# EAGLE design opencanusb2 (EAGLE 9.6.2)

## Sheet 1 of 2
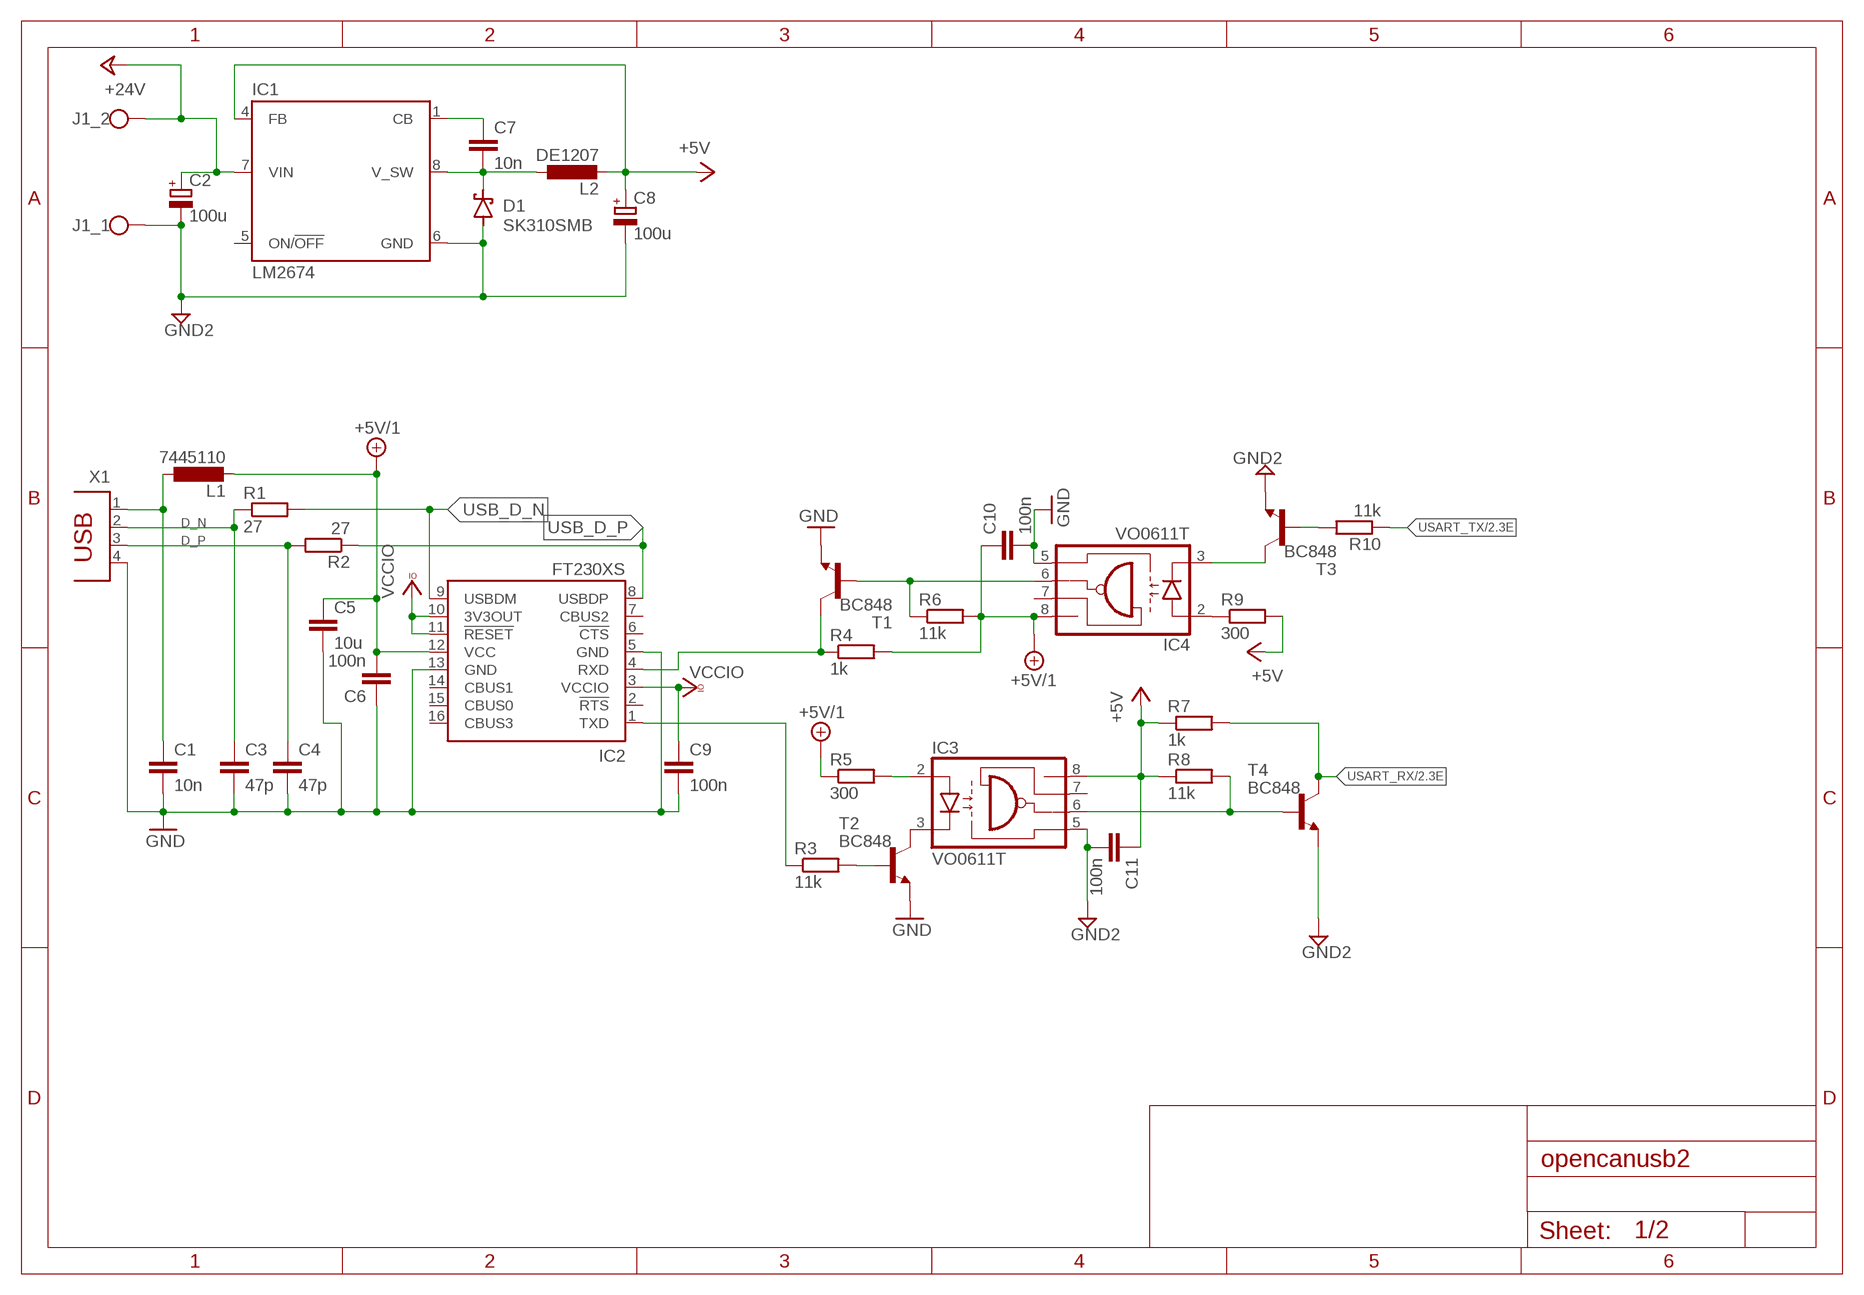
[diagram p0: schematic, sheet 1]

### Parts
C1  10n  C-EUC0402  [C0402]
C2  100u  CPOL-EUE5-8.5  [E5-8,5]
C3  47p  C-EUC0603  [C0603]
C4  47p  C-EUC0603  [C0603]
C5  10u  C-EUC1210K  [C1210K]
C6  100n  C-EUC0805  [C0805]
C7  10n  C-EUC0805  [C0805]
C8  100u  CPOL-EUE5-8.5  [E5-8,5]
C9  100n  C-EUC0805  [C0805]
C10  100n  C-EUC0805  [C0805]
C11  100n  C-EUC0805  [C0805]
D1  SK310SMB  MBRS130LT3  [SMB]
IC1  LM2674  [SOIC127P599X265-8N]
IC2  FT230XS  [SSOP16]
IC3  VO0611T  [SOIC127P610X323-8N]
IC4  VO0611T  [SOIC127P610X323-8N]
J1  DG300-7.5  [DG300-7.5]
L1  7445110  [7445110]
L2  DE1207  [INDC120120X800N]
R1  27  R-EU_R0805  [R0805]
R2  27  R-EU_R0805  [R0805]
R3  11k  R-EU_R1206  [R1206]
R4  1k  R-EU_R0805  [R0805]
R5  300  R-EU_R0805  [R0805]
R6  11k  R-EU_R1206  [R1206]
R7  1k  R-EU_R0805  [R0805]
R8  11k  R-EU_R1206  [R1206]
R9  300  R-EU_R0805  [R0805]
R10  11k  R-EU_R1206  [R1206]
T1  BC848  [SOT23]
T2  BC848  [SOT23]
T3  BC848  [SOT23]
T4  BC848  [SOT23]
X1  PN61729  [PN61729]

### Nets
+5V: C8.+ C11.1 IC1.4(FB) IC3.8(VCC) L2.2 R7.1 R8.1 R9.2 ; also sheet 2
+5V/1: C5.1 C6.2 C10.1 IC2.12(VCC) IC4.8(VCC) L1.2 R4.2 R5.1 R6.2
+24V [+24V]: C2.+ IC1.7(VIN) J1.P$2 ; also sheet 2
D_N: C3.1 R1.1 X1.2
D_P: C4.1 R2.2 X1.3
GND: C1.2 C3.2 C4.2 C5.2 C6.1 C9.2 C10.2 IC2.5(GND) IC2.13(GND) IC4.5(GND) T1.2(E) T2.2(E) X1.4
GND2: C2.- C8.- C11.2 D1.A IC1.6(GND) IC3.5(GND) J1.P$1 T3.2(E) T4.2(E) ; also sheet 2
N$1: IC3.2(A) R5.2
N$2: IC2.1(TXD) R3.1
N$3: IC3.3(C) T2.3(C)
N$4: IC4.2(A) R9.1
N$5: IC4.3(C) T3.3(C)
N$6: IC4.6(VO) R6.1 T1.1(B)
N$7: R3.2 T2.1(B)
N$8: IC3.6(VO) R8.2 T4.1(B)
N$9: R10.2 T3.1(B)
N$10: IC2.4(RXD) R4.1 T1.3(C)
N$25: C1.1 L1.1 X1.1
N$32: C7.2 D1.C IC1.8(V_SW) L2.1
N$33: C7.1 IC1.1(CB)
USART_RX [signal]: R7.2 T4.3(C) ; also sheet 2
USART_TX [signal]: R10.1 ; also sheet 2
USB_D_N [signal]: IC2.9(USBDM) R1.2
USB_D_P [signal]: IC2.8(USBDP) R2.1
VCCIO: C9.1 IC2.3(VCCIO) IC2.10(3V3OUT) IC2.11(!RESET)
Unconnected: IC2.2(!RTS) IC2.6(!CTS) IC2.7(CBUS2) IC2.14(CBUS1) IC2.15(CBUS0) IC2.16(CBUS3) IC3.7(VE) IC4.7(VE)

## Sheet 2 of 2
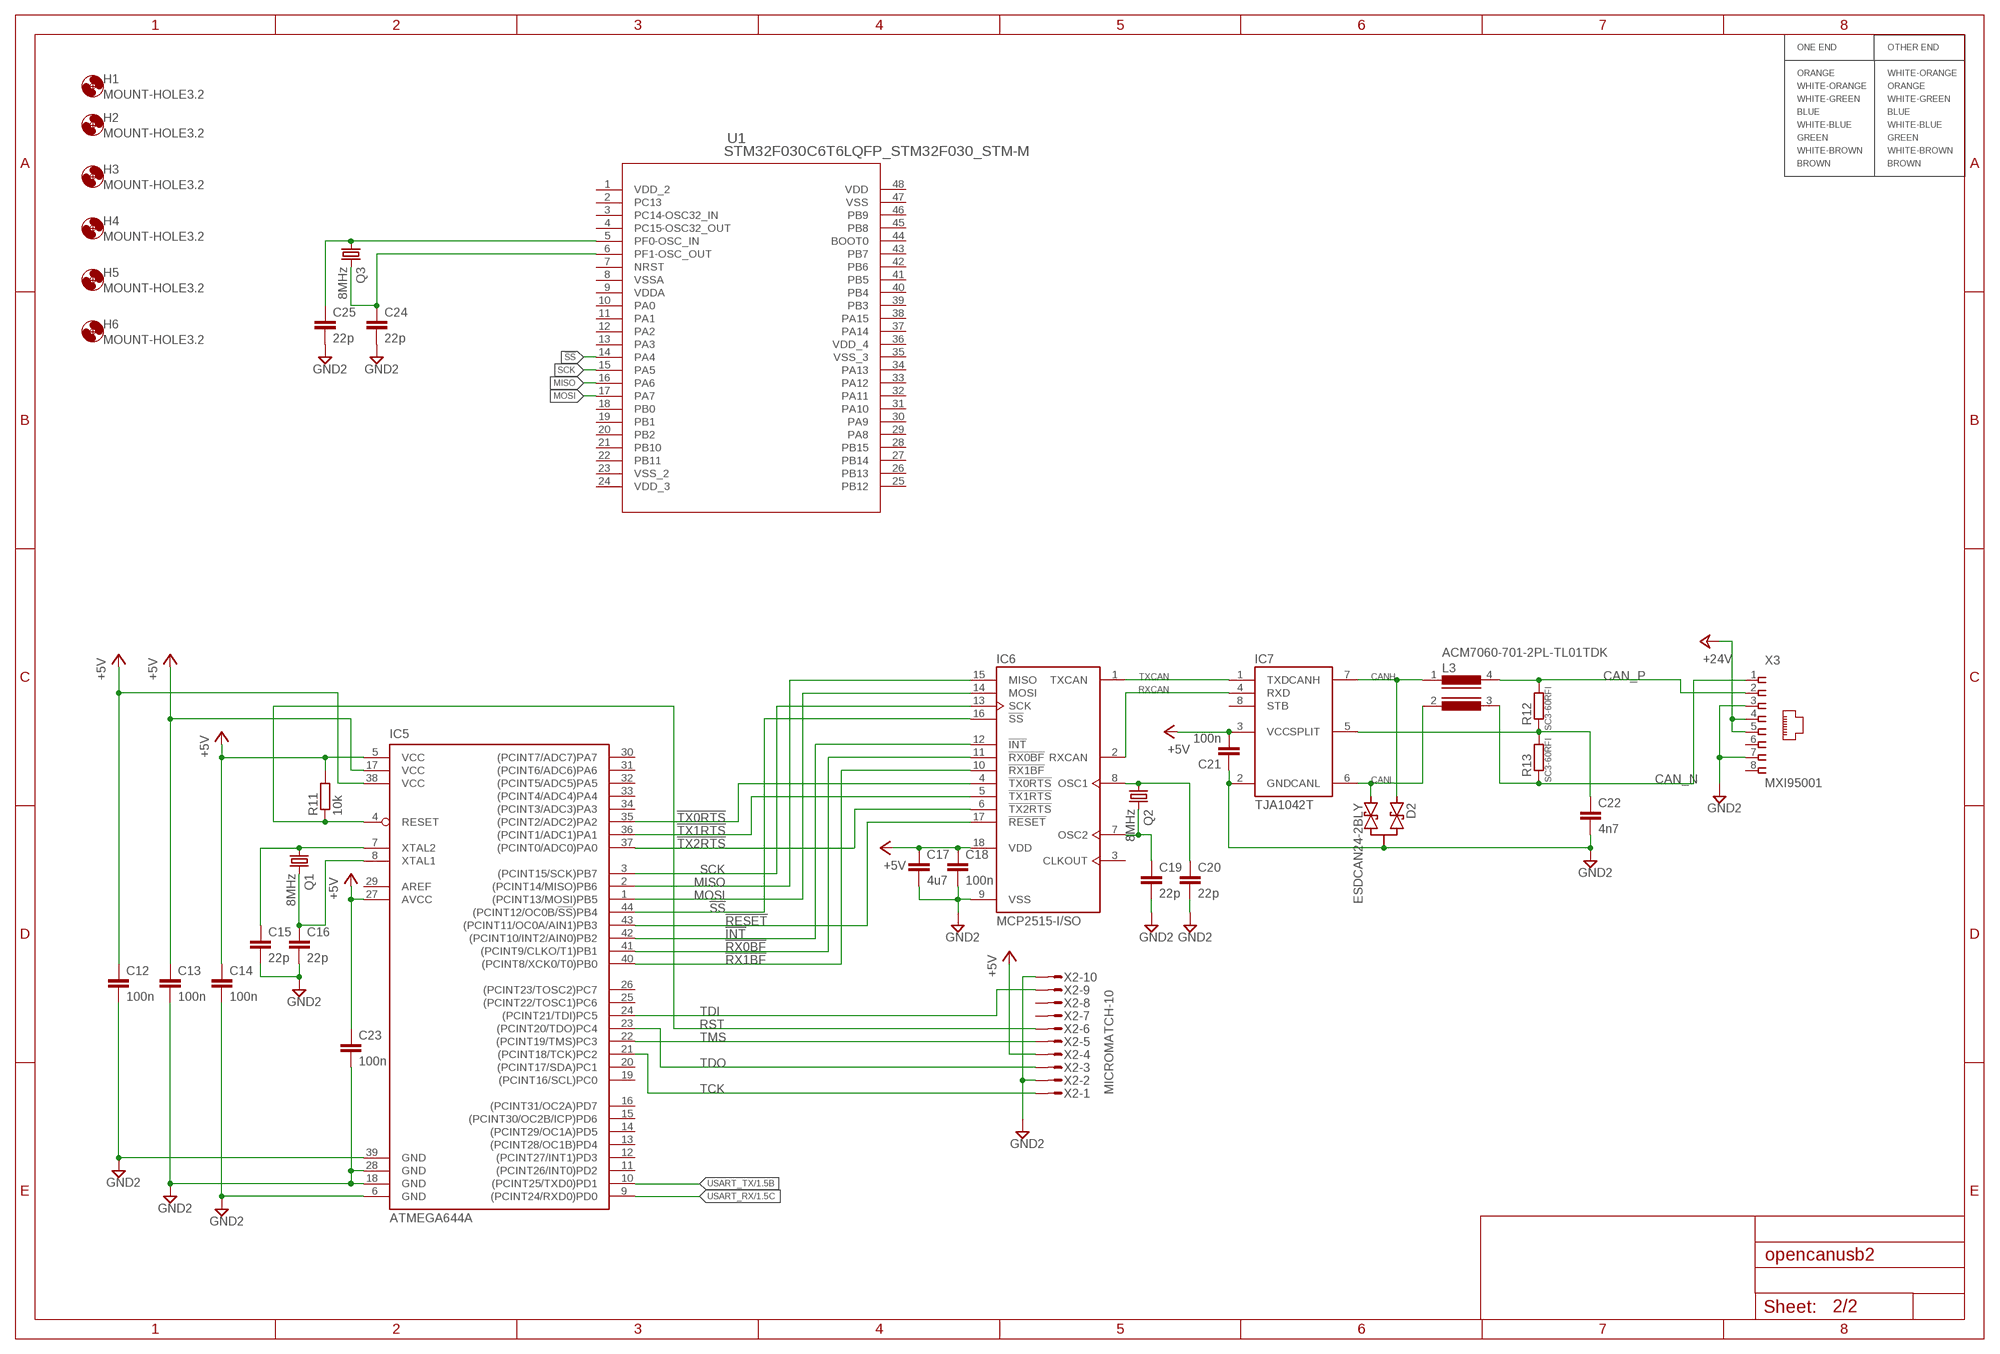
[diagram p1: schematic, sheet 2]

### Parts
C12  100n  C-EUC0805  [C0805]
C13  100n  C-EUC0805  [C0805]
C14  100n  C-EUC0805  [C0805]
C15  22p  C-EUC0805  [C0805]
C16  22p  C-EUC0805  [C0805]
C17  4u7  C-EUC0805  [C0805]
C18  100n  C-EUC0805  [C0805]
C19  22p  C-EUC0805  [C0805]
C20  22p  C-EUC0805  [C0805]
C21  100n  C-EUC0805  [C0805]
C22  4n7  C-EUC0805  [C0805]
C23  100n  C-EUC0805  [C0805]
C24  22p  C-EUC0805  [C0805]
C25  22p  C-EUC0805  [C0805]
D2  ESDCAN24-2BLY  [SOT95P255X140-3N]
H1  MOUNT-HOLE3.2  [3,2]
H2  MOUNT-HOLE3.2  [3,2]
H3  MOUNT-HOLE3.2  [3,2]
H4  MOUNT-HOLE3.2  [3,2]
H5  MOUNT-HOLE3.2  [3,2]
H6  MOUNT-HOLE3.2  [3,2]
IC5  ATMEGA644A  [TQFP44]
IC6  MCP2515-I/SO  [SOIC127P1030X265-18N]
IC7  TJA1042T  [SOIC127P600X265-8N]
L3  ACM7060-701-2PL-TL01TDK  [ACM7060-701-2PL-TL01TDK]
Q1  8MHz  CRYSTALHC49UP  [HC49UP]
Q2  8MHz  CRYSTALHC49UP  [HC49UP]
Q3  8MHz  CRYSTALHC49UP  [HC49UP]
R11  10k  R-EU_R1206  [R1206]
R12  SC3-60RFI  SC3-XXRFI  [RESC3163X76N]
R13  SC3-60RFI  SC3-XXRFI  [RESC3163X76N]
U1  STM32F030C6T6LQFP_STM32F030_STM-M  [LQFP_STM32F030_STM-M]
X2  MICROMATCH-10  [MICROMATCH-10]
X3  MXI95001  [MXI950001]

### Nets
!INT [signal]: IC5.42((PCINT10/INT2/AIN0)PB2) IC6.12(!INT)
!RESET [signal]: IC5.43((PCINT11/OC0A/AIN1)PB3) IC6.17(!RESET)
!RX0BF [signal]: IC5.41((PCINT9/CLKO/T1)PB1) IC6.11(!RX0BF)
!RX1BF [signal]: IC5.40((PCINT8/XCK0/T0)PB0) IC6.10(!RX1BF)
!SS [signal]: IC5.44((PCINT12/OC0B/!SS!)PB4) IC6.16(!SS) U1.14(PA4)
!TX0RTS: IC5.35((PCINT2/ADC2)PA2) IC6.4(!TX0RTS)
!TX1RTS [signal]: IC5.36((PCINT1/ADC1)PA1) IC6.5(!TX1RTS)
!TX2RTS [signal]: IC5.37((PCINT0/ADC0)PA0) IC6.6(!TX2RTS)
+5V: C12.1 C13.1 C14.1 C17.1 C18.1 C21.2 C23.1 IC5.5(VCC) IC5.17(VCC) IC5.27(AVCC) IC5.38(VCC) IC6.18(VDD) IC7.3(VCC) R11.2 X2.4 ; also sheet 1
+24V [+24V]: X3.4 X3.5 ; also sheet 1
CAN_N: L3.3 R13.1 X3.1
CAN_P: L3.4 R12.2 X3.2
CANH: D2.1 IC7.7(CANH) L3.1
CANL: D2.2 IC7.6(CANL) L3.2
GND2: C12.2 C13.2 C14.2 C15.2 C16.2 C17.2 C18.2 C19.2 C20.2 C21.1 C22.2 C23.2 C24.2 C25.2 D2.3 IC5.6(GND) IC5.18(GND) IC5.28(GND) IC5.39(GND) IC6.9(VSS) IC7.2(GND) X2.2 X2.10 X3.3 X3.7 ; also sheet 1
MISO [signal]: IC5.2((PCINT14/MISO)PB6) IC6.15(MISO) U1.16(PA6)
MOSI [signal]: IC5.1((PCINT13/MOSI)PB5) IC6.14(MOSI) U1.17(PA7)
N$11: C25.1 Q3.1 U1.5(PF0-OSC_IN)
N$12: C24.1 Q3.2 U1.6(PF1-OSC_OUT)
N$17 [signal]: C15.1 IC5.7(XTAL2) Q1.1
N$22 [signal]: C19.1 IC6.7(OSC2) Q2.2
N$24 [signal]: C16.1 IC5.8(XTAL1) Q1.2
N$26 [signal]: C20.1 IC6.8(OSC1) Q2.1
N$31: C22.1 IC7.5(SPLIT) R12.1 R13.2
RST [signal]: IC5.4(RESET) R11.1 X2.6
RXCAN [signal]: IC6.2(RXCAN) IC7.4(RXD)
SCK [signal]: IC5.3((PCINT15/SCK)PB7) IC6.13(SCK) U1.15(PA5)
TCK: IC5.21((PCINT18/TCK)PC2) X2.1
TDI: IC5.24((PCINT21/TDI)PC5) X2.9
TDO: IC5.23((PCINT20/TDO)PC4) X2.3
TMS: IC5.22((PCINT19/TMS)PC3) X2.5
TXCAN [signal]: IC6.1(TXCAN) IC7.1(TXD)
USART_RX [signal]: IC5.9((PCINT24/RXD0)PD0) ; also sheet 1
USART_TX [signal]: IC5.10((PCINT25/TXD0)PD1) ; also sheet 1
Unconnected: IC5.11((PCINT26/INT0)PD2) IC5.12((PCINT27/INT1)PD3) IC5.13((PCINT28/OC1B)PD4) IC5.14((PCINT29/OC1A)PD5) IC5.15((PCINT30/OC2B/ICP)PD6) IC5.16((PCINT31/OC2A)PD7) IC5.19((PCINT16/SCL)PC0) IC5.20((PCINT17/SDA)PC1) IC5.25((PCINT22/TOSC1)PC6) IC5.26((PCINT23/TOSC2)PC7) IC5.29(AREF) IC5.30((PCINT7/ADC7)PA7) IC5.31((PCINT6/ADC6)PA6) IC5.32((PCINT5/ADC5)PA5) IC5.33((PCINT4/ADC4)PA4) IC5.34((PCINT3/ADC3)PA3) IC6.3(CLKOUT) IC7.8(STB) U1.2(PC13) U1.3(PC14-OSC32_IN) U1.4(PC15-OSC32_OUT) U1.7(NRST) U1.8(VSSA) U1.10(PA0) U1.11(PA1) U1.12(PA2) U1.13(PA3) U1.18(PB0) U1.19(PB1) U1.20(PB2) U1.21(PB10) U1.22(PB11) U1.23(VSS_2) U1.25(PB12) U1.26(PB13) U1.27(PB14) U1.28(PB15) U1.29(PA8) U1.30(PA9) U1.31(PA10) U1.32(PA11) U1.33(PA12) U1.34(PA13) U1.35(VSS_3) U1.37(PA14) U1.38(PA15) U1.39(PB3) U1.40(PB4) U1.41(PB5) U1.42(PB6) U1.43(PB7) U1.44(BOOT0) U1.45(PB8) U1.46(PB9) U1.47(VSS) X2.7 X2.8 X3.6 X3.8

### Notes on the sheet
- ONE END | OTHER END
- ORANGE | WHITE-ORANGE
- WHITE-ORANGE | ORANGE
- WHITE-GREEN | WHITE-GREEN
- BLUE | BLUE
- WHITE-BLUE | WHITE-BLUE
- GREEN | GREEN
- WHITE-BROWN | WHITE-BROWN
- BROWN | BROWN

## Power pins joined to a net without a drawn wire
ON/!OFF: IC1.5(ON/!OFF)
VDD: U1.48(VDD)
VDD_2: U1.1(VDD_2)
VDD_3: U1.24(VDD_3)
VDD_4: U1.36(VDD_4)
VDDA: U1.9(VDDA)

## Library data of the parts
C1 C3-C7 C9-C25 = rcl:C-EU: CAPACITOR, European symbol; SPICEPREFIX: C
C2 C8 = rcl:CPOL-EU: POLARIZED CAPACITOR, European symbol; SPICEPREFIX: C
D1 = diode:MBRS130LT3: Schottky Power Rectifier Source: http://www.onsemi.com/pub/Collateral/MBRS130LT3-D.PDF
D2 = canusb:ESDCAN24-2BLY: ESDCAN01-2BLY Automotive dual-line Transil™,transient voltage suppressor (TVS) for CAN bus
H1-H6 = holes:MOUNT-HOLE: MOUNTING HOLE with drill center marker
IC1 = canusb:LM2674: LM2674 SIMPLE SWITCHER® Power Converter High Efficiency 500-mA Step-Down Voltage Regulator
IC2 = ftdichip:FT230X: USB to BASIC UART IC Auto generated by make-symbol-device-package-bsdl.ulp Rev. 43 Source: Data sheet <http://www.ftdichip.com/Support/Documents/DataSheets/ICs/DS_FT230X.pdf>
IC3 IC4 = cnc_driver:VO0611T: VO0611T - High Speed Optocoupler, 10 MBd, SOIC-8 Package The VO06xxT family are single and dual channel 10 MBd optocoupler utilizing a high efficient input LED coupled with an integrated optical photodiode IC detector. The detector has an open drain NMOS-transister output, providing less leakage compared to an open collector Schottky clamped transister output. For the single channel type, an enable function on pin 7 allows the detector to be strobed. The internal shield provides a guaranteed common mode transient immunity of 5 kV/μs for the VO0601T and VO0631T and 15 kV/μs for the VO0611T and VO0661T. The use of a 0.1 μF bypass capacitor connected between pin 5 and 8 is recommended.
IC5 = atmel:ATMEGA644: 8-bit Microcontroller with 64K Bytes In-System Programmable Flash Source: http://www.atmel.com/dyn/resources/prod_documents/doc2593.pdf; MPN: ATMEGA644PV-10AU; OC_FARNELL: 1455123; OC_NEWARK: 58M3748
IC6 = canusb:MCP2515: MCP2515 - Stand-Alone CAN Controller with SPI Interface
IC7 = canusb:TJA1042: TJA1042 - High-speed CAN transceiver with Standby mode General description he TJA1042 is a high-speed CAN transceiver that provides an interface between aController Area Network (CAN) protocol controller and the physical two-wire CAN bus.The transceiver is designed for high-speed (up to 1 Mbit/s) CAN applications in theautomotive industry, providing the differential transmit and receive capability to (amicrocontroller with) a CAN protocol controller. The TJA1042 is a step up from the TJA1040, PCA82C250 and PCA82C251 high-speedCAN transceivers. It offers improved ElectroMagnetic Compatibility (EMC) andElectroStatic Discharge (ESD) performance, and also features: Ideal passive behavior to the CAN bus when the supply voltage is off A very low-current Standby mode with bus wake-up capability Direct interfacing to microcontrollers with 3 V to 5 V supply voltages on TJA1042T/3 and TJA1042TK/3These features make the TJA1042 an excellent choice for all types of HS-CAN networks, in nodes that require a low-power mode with wake-up capability via the CAN bus Features General Fully ISO 11898-2 and ISO 11898-5 compliant Suitable for 12 V and 24 V systems Low ElectroMagnetic Emission (EME) and high ElectroMagnetic Immunity (EMI) VIO input on TJA1042T/3 and TJA1042TK/3 allows for direct interfacing with 3 V to 5 V microcontrollers (available in SO8 and very small HVSON8 packages respectively) SPLIT voltage output on TJA1042T for stabilizing the recessive bus level (available inSO8 package only) Low-power management Very low-current Standby mode with host and bus wake-up capability Functional behavior predictable under all supply conditions Transceiver disengages from the bus when not powered up (zero load) Protections High ESD handling capability on the bus pins Bus pins protected against transients in automotive environments Transmit Data (TXD) dominant time-out function Bus-dominant time-out function in Standby mode Undervoltage detection on pins VCC and VIO Thermally protected
J1 = canusb:DG300-7.5: DEGSON DG300-7.5 PCB terminal block
L1 = canusb:7445110: WE-PD3 SMT Shielded Power Inductor
L2 = cnc_driver:DE1207: DE1207-10 FERROCORE Dławik: drutowy; SMD; 10uH; 6,7A; 19mΩ; ±20%; 12x12x8mm; -40÷85°C
L3 = canusb:ACM7060-701-2PL-TL01TDK: ACM7060-701-2PL-TL01 TDK Common mode filter
Q1-Q3 = crystal:CRYSTAL: CRYSTAL; OC_FARNELL: unknown; OC_NEWARK: unknown
R1-R11 = rcl:R-EU_: RESISTOR, European symbol; SPICEPREFIX: R
R12 R13 = canusb:SC3: SC3 Series - High Power Chip Resistors 3 watts in a 1 watt size package Resistance range from 1R0 to 10K Tolerances to ± 1% AEC-Q200 Qualified link to datascheet: http://www.farnell.com/datasheets/2710392.pdf
T1-T4 = transistor:BC848: NPN TRANSISTOR
U1 = canusb:STM32F030C6T6; BUILT_BY: EMA_Matt; COPYRIGHT: Copyright (C) 2018 Accelerated Designs. All rights reserved; DATASHEET: https://www.st.com/content/ccc/resource/technical/document/datasheet/a4/5d/0b/0e/87/c4/4d/71/DM00088500.pdf/files/DM00088500.pdf/jcr:content/translations/en.DM00088500.pdf; MANUFACTURER_PART_NUMBER: STM32F030C6T6; SOURCELIBRARY: Add_to_database_2020-12-31; VENDOR: STMicroelectronics
X1 = con-berg:PN61729: BERG USB connector; OC_FARNELL: unknown; OC_NEWARK: unknown
X2 = con-amp-micromatch:MICROMATCH-10: MicroMaTch 10 8-215464-0 / 1-215464-0 Drawing Number C-215464 DDEController.pdf; MF: FARNELL; MPN: 8-215464-0; OC_FARNELL: 3784654; OC_NEWARK: 19J6430
X3 = canusb:MXI95001: 95501-2881 MOLEX Socket; RJ45; PIN: 8; Cat: 3; lowprofile; setup: 8p8c; THT

## Net classes
1 signal: width 0.305 mm, drill 0.4 mm, clearance 0.305 mm
2 +24V: clearance 1.016 mm

## Board
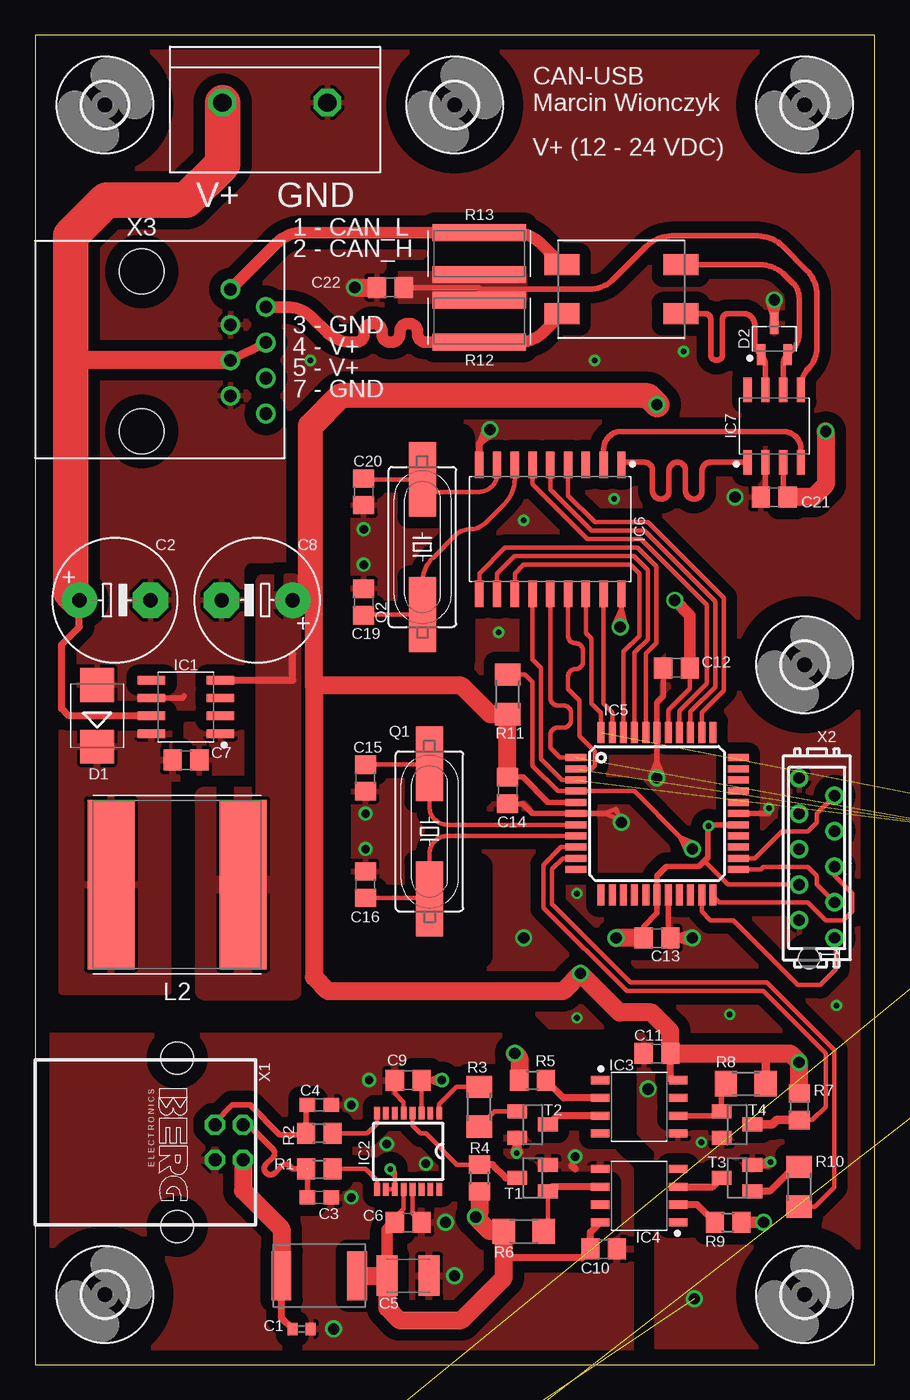
[diagram p2: board, top side]
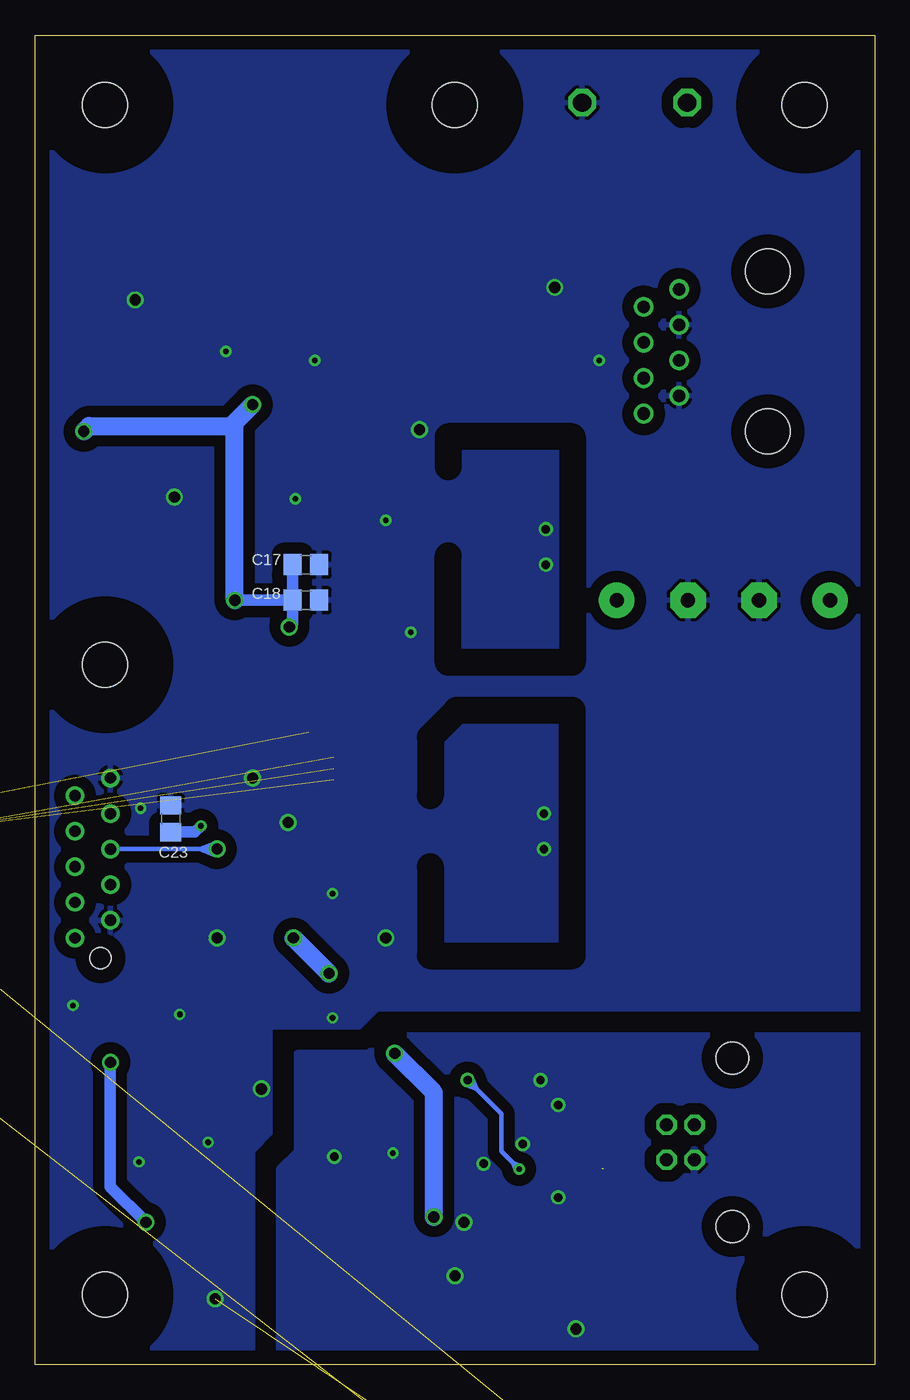
[diagram p3: board, bottom side, seen from below]

Size 60 x 95 mm. Coordinates in mm from the lower left corner, seen from the top.
Outline: 0,0 60,0 60,95 0,95 0,0
Copper layers (1*16): Top 0.035mm / dielectric 1.5mm / Bottom 0.035mm
Design rules "default *": minimum track width 6mil, minimum drill 0.35mm, track to track 6mil, track to pad 6mil, pad to pad 6mil, via to via 6mil, smd to smd 6mil, copper to edge 40mil, drill to drill 6mil, minimum pad ring 10mil, minimum via ring 8mil, stop-mask expansion 4mil, vias tented up to drill 0.4mm, thermal gap 10mil
tRestrict: 11 lines
bRestrict: 11 lines

### Footprints (pad centres in the part's own frame; a part is rotated, then mirrored left to right if it is on the bottom)
C0402 = smd 0.7 x 0.9: 1 -0.65,0; 2 0.65,0
E5-8,5 = drill 1.016 pad 2.54: + -2.54,0 | drill 1.016 pad 2.54 octagon: - 2.54,0
C0603 = smd 1.1 x 1: 1 -0.85,0; 2 0.85,0
C1210K = smd 1.5 x 2.9: 1 -1.5,0; 2 1.5,0
C0805 = smd 1.3 x 1.5: 1 -0.95,0; 2 0.95,0
SMB = smd 2.4 x 2.4: A 2.2,0; C -2.2,0
SOT95P255X140-3N = smd 1.494 x 0.598: 1 -1.107,0.95; 2 -1.107,-0.95; 3 1.107,0
3,2 = hole 3.2: 0,0
SOIC127P599X265-8N = smd 1.967 x 0.599: 1 -2.469,1.905; 2 -2.469,0.635; 3 -2.469,-0.635; 4 -2.469,-1.905; 5 2.469,-1.905; 6 2.469,-0.635; 7 2.469,0.635; 8 2.469,1.905
SSOP16 = smd 0.914 x 0.406: 1 -2.718,2.223; 2 -2.718,1.587; 3 -2.718,0.953; 4 -2.718,0.318; 5 -2.718,-0.318; 6 -2.718,-0.953; 7 -2.718,-1.587; 8 -2.718,-2.223; 9 2.718,-2.223; 10 2.718,-1.587; 11 2.718,-0.953; 12 2.718,-0.318; 13 2.718,0.318; 14 2.718,0.953; 15 2.718,1.587; 16 2.718,2.223
SOIC127P610X323-8N = smd 1.347 x 0.582: 1 -2.782,1.905; 2 -2.782,0.635; 3 -2.782,-0.635; 4 -2.782,-1.905; 5 2.782,-1.905; 6 2.782,-0.635; 7 2.782,0.635; 8 2.782,1.905
TQFP44 = smd 1.5 x 0.5: 1 -5.8,4; 2 -5.8,3.2; 3 -5.8,2.4; 4 -5.8,1.6; 5 -5.8,0.8; 6 -5.8,0; 7 -5.8,-0.8; 8 -5.8,-1.6; 9 -5.8,-2.4; 10 -5.8,-3.2; 11 -5.8,-4; 23 5.8,-4; 24 5.8,-3.2; 25 5.8,-2.4; 26 5.8,-1.6; 27 5.8,-0.8; 28 5.8,0; 29 5.8,0.8; 30 5.8,1.6; 31 5.8,2.4; 32 5.8,3.2; 33 5.8,4 | smd 0.5 x 1.5: 12 -4,-5.8; 13 -3.2,-5.8; 14 -2.4,-5.8; 15 -1.6,-5.8; 16 -0.8,-5.8; 17 0,-5.8; 18 0.8,-5.8; 19 1.6,-5.8; 20 2.4,-5.8; 21 3.2,-5.8; 22 4,-5.8; 34 4,5.8; 35 3.2,5.8; 36 2.4,5.8; 37 1.6,5.8; 38 0.8,5.8; 39 0,5.8; 40 -0.8,5.8; 41 -1.6,5.8; 42 -2.4,5.8; 43 -3.2,5.8; 44 -4,5.8
SOIC127P1030X265-18N = smd 1.901 x 0.599: 1 -4.605,5.08; 2 -4.605,3.81; 3 -4.605,2.54; 4 -4.605,1.27; 5 -4.605,0; 6 -4.605,-1.27; 7 -4.605,-2.54; 8 -4.605,-3.81; 9 -4.605,-5.08; 10 4.605,-5.08; 11 4.605,-3.81; 12 4.605,-2.54; 13 4.605,-1.27; 14 4.605,0; 15 4.605,1.27; 16 4.605,2.54; 17 4.605,3.81; 18 4.605,5.08
SOIC127P600X265-8N = smd 1.746 x 0.592: 1 -2.585,1.905; 2 -2.585,0.635; 3 -2.585,-0.635; 4 -2.585,-1.905; 5 2.585,-1.905; 6 2.585,-0.635; 7 2.585,0.635; 8 2.585,1.905
DG300-7.5 = drill 1.3 octagon: P$1 -3.75,0; P$2 3.75,0
7445110 = smd 1.4 x 3.5: 1 -2.7,0; 2 2.7,0
INDC120120X800N = smd 3.362 x 12.112: 1 -4.725,0; 2 4.725,0
ACM7060-701-2PL-TL01TDK = smd 2.5 x 1.5: 1 -4.25,1.75; 2 -4.25,-1.75; 3 4.25,-1.75; 4 4.25,1.75
HC49UP = smd 5.334 x 1.93: 1 -4.826,0; 2 4.826,0
R0805 = smd 1.3 x 1.5: 1 -0.95,0; 2 0.95,0
R1206 = smd 1.6 x 1.803: 1 -1.422,0; 2 1.422,0
RESC3163X76N = smd 1.198 x 6.67: 1 -1.501,0; 2 1.501,0
SOT23 = smd 1 x 1.4: 1 -0.95,-1.1; 2 0.95,-1.1; 3 0,1.1
LQFP_STM32F030_STM-M = smd 1.562 x 0.279: 1 -4.375,2.75; 2 -4.375,2.25; 3 -4.375,1.75; 4 -4.375,1.25; 5 -4.375,0.75; 6 -4.375,0.25; 7 -4.375,-0.25; 8 -4.375,-0.75; 9 -4.375,-1.25; 10 -4.375,-1.75; 11 -4.375,-2.25; 12 -4.375,-2.75; 25 4.375,-2.75; 26 4.375,-2.25; 27 4.375,-1.75; 28 4.375,-1.25; 29 4.375,-0.75; 30 4.375,-0.25; 31 4.375,0.25; 32 4.375,0.75; 33 4.375,1.25; 34 4.375,1.75; 35 4.375,2.25; 36 4.375,2.75 | smd 0.279 x 1.562: 13 -2.75,-4.375; 14 -2.25,-4.375; 15 -1.75,-4.375; 16 -1.25,-4.375; 17 -0.75,-4.375; 18 -0.25,-4.375; 19 0.25,-4.375; 20 0.75,-4.375; 21 1.25,-4.375; 22 1.75,-4.375; 23 2.25,-4.375; 24 2.75,-4.375; 37 2.75,4.375; 38 2.25,4.375; 39 1.75,4.375; 40 1.25,4.375; 41 0.75,4.375; 42 0.25,4.375; 43 -0.25,4.375; 44 -0.75,4.375; 45 -1.25,4.375; 46 -1.75,4.375; 47 -2.25,4.375; 48 -2.75,4.375
PN61729 = drill 0.95 octagon: 1 1.25,4.71; 2 -1.25,4.71; 3 -1.25,2.71; 4 1.25,2.71 | hole 2.3: -6.02,0; 6.02,0
MICROMATCH-10 = drill 0.813: 1 5.715,1.27; 2 4.445,-1.27; 3 3.175,1.27; 4 1.905,-1.27; 5 0.635,1.27; 6 -0.635,-1.27; 7 -1.905,1.27; 8 -3.175,-1.27; 9 -4.445,1.27; 10 -5.715,-1.27 | hole 1.5: 7.16,-0.55
MXI950001 = drill 0.9: 1 4.445,-6.35; 2 3.175,-8.89; 3 1.905,-6.35; 4 0.635,-8.89; 5 -0.635,-6.35; 6 -1.905,-8.89; 7 -3.175,-6.35; 8 -4.445,-8.89 | hole 3.2: 5.715,0; -5.715,0

### Placement (x,y rotation side)
C1  19.05,2.54 0 top
C2  5.71,54.61 0 top
C3  20.32,11.94 0 top
C4  20.32,18.54 0 top
C5  26.67,6.35 0 top
C6  26.67,10.16 180 top
C7  10.79,43.18 180 top
C8  15.88,54.61 180 top
C9  26.67,20.32 180 top
C10  40.64,8.26 0 top
C11  44.45,22.23 180 top
C12  45.85,49.78 180 top
C13  44.45,30.48 0 top
C14  33.78,41.02 270 top
C15  23.62,41.91 270 top
C16  23.62,34.29 90 top
C17  40.64,57.15 0 bottom
C18  40.64,54.61 0 bottom
C19  23.5,54.48 90 top
C20  23.5,62.36 270 top
C21  52.83,61.98 0 top
C22  25.4,76.96 180 top
C23  50.29,38.99 90 bottom
C24  -8.26,-31.75 0 top  (outside the outline)
C25  -8.26,-38.1 0 top  (outside the outline)
D1  4.45,46.35 90 top
D2  52.83,73.28 90 top
H1  55,90 0 top
H2  55,5 0 top
H3  5,90 0 top
H4  55,50 0 top
H5  5,5 0 top
H6  30,90 0 top
IC1  10.79,46.99 180 top
IC2  26.67,15.24 270 top
IC3  43.18,18.41 0 top
IC4  43.18,12.06 180 top
IC5  44.45,39.37 0 top
IC6  36.83,59.69 270 top
IC7  52.83,67.06 90 top
J1  17.14,90.17 180 top
L1  20.32,6.35 0 top
L2  10.16,34.29 0 top
L3  41.91,76.83 180 top
Q1  28.19,38.1 270 top
Q2  27.69,58.42 270 top
Q3  88.9,44.45 180 top  (outside the outline)
R1  20.32,13.97 0 top
R2  20.32,16.51 180 top
R3  31.75,18.41 270 top
R4  31.75,13.34 270 top
R5  35.56,20.32 0 top
R6  34.92,9.53 180 top
R7  54.61,18.41 270 top
R8  50.8,20.07 180 top
R9  49.53,10.16 0 top
R10  54.61,12.7 90 top
R11  33.78,47.88 270 top
R12  31.75,74.55 270 top
R13  31.75,79.38 270 top
T1  35.56,13.34 90 top
T2  35.56,17.14 270 top
T3  50.16,13.34 90 top
T4  50.16,17.14 270 top
U1  88.9,34.29 270 top  (outside the outline)
X1  10.16,15.88 270 top
X2  55.88,36.2 270 top
X3  7.62,72.39 90 top

### Tracks (layer width: path | path; a pad name or v marks a point on that pad's centre or on a via)
!INT
  Top 0.305: IC6.12 34.29,56.52 34.92,57.15 42.55,57.15 43.18,56.52 43.18,52.07 42.05,50.94 IC5.42
!RESET
  Top 0.305: IC6.17 40.64,47.22 41.25,46.61 IC5.43
!RX0BF
  Top 0.305: IC6.11 33.02,56.52 34.27,57.76 42.8,57.76 43.79,56.77 43.79,51.82 42.85,50.88 IC5.41
!RX1BF
  Top 0.305: 31.75,54.61 IC6.10 31.75,56.52 33.6,58.37 43.05,58.37 44.4,57.02 44.4,51.56 43.65,50.82 IC5.40
!SS  (1 unrouted)
  Top 0.305: IC5.44 40.45,46.55 39.78,47.22 39.78,51.88 39.37,52.28 IC6.16
!TX0RTS
  Top 0.305: 38.1,64.77 IC6.4 38.1,62.1 40.01,60.2 43.81,60.2 49.23,54.78 49.23,48.16 47.65,46.59 IC5.35
!TX1RTS
  Top 0.305: IC5.36 46.85,46.65 48.62,48.41 48.62,54.53 43.55,59.59 39.75,59.59 36.83,62.51 IC6.5
!TX2RTS
  Top 0.305: IC5.37 46.05,46.71 48.01,48.67 48.01,54.27 43.3,58.98 39.5,58.98 35.56,62.92 IC6.6
+5V  (via drill 0.4, 0.8)
  Top 0.305: IC5.38 45.25,46.77 46.8,48.32 C12.1 | X2.4 49.53,34.29 47.84,35.98
  Top 0.406: IC5.5 36.66,40.17 34.86,41.97 C14.1 | C13.1 43.5,31.31 44.45,32.26 IC5.17 44.45,34.92 45.12,35.59 47.45,35.59 47.84,35.98 48.1,36.24 48.1,38.45 v48.13,38.48 | IC7.3 53.47,62.29 C21.2 | IC6.18 41.91,53.9 | 41.91,53.9 41.91,52.79 v41.83,52.7 | IC3.8 45.47,20.32 45.4,20.39 | 41.91,53.9 41.46,52.86 v41.83,52.7 | 41.91,53.9 42.21,52.81 v41.83,52.7 | IC5.27 48.22,38.57 v48.13,38.48 | 48.26,38.35 v48.13,38.48
  Top 0.508: IC1.4 18.41,48.9 18.41,50.8 | 45.4,20.39 C11.1
  Top 0.61: 52.22,22.23 R8.1
  Top 0.813: R9.2 v52.07,10.16 | C12.1 46.8,53.53 v45.72,54.61
  Top 1.27: C14.1 R11.2 32.54,46.46 30.48,48.51 19.94,48.51 | R7.1 v54.61,21.59 53.98,22.23 52.22,22.23 C11.1 45.4,23.82 44.07,25.15 41.78,25.15 v38.99,27.94 37.72,26.67 20.95,26.67 19.94,27.69 19.94,48.51 | C13.1 v41.53,30.48 | C8.+ 19.68,54.61 19.94,54.61 19.94,48.51 | v56.52,66.67 56.52,62.87 55.63,61.98 C21.2
  Top 1.8: 19.68,54.61 19.68,67.06 21.84,69.22 43.81,69.22 v44.45,68.58
  Bottom 0.813: C17.1 C18.1 | v52.07,10.16 54.61,12.7 v54.61,21.59 | v41.83,52.7 41.59,52.94 C18.1 | v45.72,54.61 C18.1 | C23.1 48.58,38.04 v48.13,38.48
  Bottom 1.27: v41.53,30.48 v38.99,27.94 | v45.72,54.61 45.72,67.31 | v44.45,68.58 45.72,67.31 | v56.52,66.67 56.13,67.06 45.97,67.06 45.72,67.31
  pour Top (isolate 0.813): 16.38,55.88 16.38,40.64 12.06,40.64 12.06,26.67 18.41,26.67 18.41,55.88
+5V/1  (via drill 0.8)
  Top 0.305: IC2.12 26.35,11.11 25.4,10.16 C6.2
  Top 0.508: 39.76,8.33 C10.1 | C10.1 39.05,7.62 33.5,7.62 | C10.1 39.69,9.45 IC4.8
  Top 0.813: C5.1 25.17,9.61 C6.2
  Top 1.27: L1.2 C5.1 25.17,4.04 26.04,3.17 30.48,3.17 33.5,6.2 33.5,7.62 R6.2 32.51,9.53 v31.5,10.54 31.75,10.79 R4.2 | v34.29,22.23 34.61,21.91 R5.1
  Bottom 1.27: v31.5,10.54 31.5,19.43 v34.29,22.23
+24V
  Top 0.508: C2.+ 3.17,52.7 1.91,51.44 1.91,46.86 2.41,46.35 IC1.7
  Top 0.61: X3.5 X3.4
  Top 1.27: X3.5 2.54,71.75
  Top 2.54: C2.+ 2.54,55.24 2.54,71.75 2.54,80.64 5.08,83.19 10.79,83.19 13.39,85.78 J1.P$2
CAN_N
  Top 0.406: R13.1 34.32,80.88
  Top 0.813: 34.32,80.88 arc-45 36.11,80.13 L3.3 | R13.1 19.06,80.88 arc45 17.27,80.13 X3.1
CAN_P
  Top 0.406: R12.2 34.57,73.05
  Top 0.813: 34.57,73.05 arc45 36.37,73.79 L3.4 | X3.2 18,75.56 arc-45 19.79,74.82 20.82,73.79 arc45 22.62,73.05 22.93,73.05 arc90 23.53,73.64 23.53,73.78 arc-90 24.13,74.38 24.2,74.38 arc-90 24.8,73.78 24.8,73.64 arc90 25.4,73.05 25.48,73.05 arc90 26.07,73.64 26.07,73.78 arc-90 26.67,74.38 26.75,74.38 arc-90 27.34,73.78 27.34,73.64 arc90 27.94,73.05 R12.2
CANH
  Top 0.406: IC7.7 52.2,71.41 arc45 D2.1 arc-45 51.44,73.25 51.44,74.3 arc90 50.65,75.08 49.53,75.08 arc90 49.14,74.69 49.14,72.16 arc-90 48.74,71.76 48.69,71.76 arc-90 48.29,72.16 48.29,74.69 arc90 47.9,75.08 L3.1
CANL
  Top 0.406: IC7.6 53.47,71.41 arc-45 D2.2 54.14,72.53 arc45 54.61,73.66 54.61,76.2 arc45 54.16,77.28 53.6,77.84 arc45 51.81,78.58 L3.2
D_N  (1 unrouted)
  Top 0.406: 19.37,14.07 R1.1 18.41,13.97 18.19,14.19 arc90 17.64,14.19 17.11,13.67 arc-90 16.56,13.67 16.5,13.73 arc-90 16.5,14.29 17.02,14.81 arc90 17.02,15.37 15.26,17.12 X1.2 | C3.1 19.47,13.97
D_P
  Top 0.406: C4.1 19.37,18.44 R2.2 19.37,16.41 17.5,16.41 15.37,18.54 14.1,18.54 12.87,17.32 X1.3
GND  (via drill 0.4, 0.6, 0.8)
  Top 0.305: IC2.13 26.99,10.79 C6.1 | IC2.5 26.35,18.73 25.72,19.36 C9.2
  Top 0.508: T2.2 34.46,15.88 | 34.46,15.88 34.46,15.16 v34.42,15.11 | 38.61,13.97 38.35,14.22 | 34.46,15.88 34.22,15.18 v34.42,15.11 | 34.46,15.88 34.64,15.13 34.47,15.1 v34.42,15.11
  other vias: 38.61,14.86 23.88,20.32 29.34,10.16 29.97,6.35 21.34,2.54 22.61,18.54 22.61,11.94 25.15,15.75 27.94,14.35
  pour Bottom (isolate 0.813): 0.64,23.5 34.92,23.5 36.2,22.23 41.27,22.23 41.27,15.24 42.55,13.97 42.55,0.64 0.64,0.64
  pour Top (isolate 0.813): 0.64,23.5 34.92,23.5 36.2,22.23 41.27,22.23 41.27,15.24 42.55,13.97 42.55,0.64 0.64,0.64
GND2  (via drill 0.4, 0.6, 0.8)  (2 unrouted)
  Top 0.305: 45.25,30.63 C13.2 | 44.45,43.11 v44.45,41.91 | 44.45,43.11 44.03,42.08 v44.45,41.91 | 44.45,43.11 44.87,42.08 v44.45,41.91 | 52.45,39.37 v52.45,39.75 | 40.71,39.37 41.96,38.86 v41.91,38.73 41.52,39.7 40.71,39.37
  Top 0.406: C14.2 34.86,40.07 35.56,39.37 IC5.6 40.71,39.37 | IC5.18 45.25,30.63 | C12.2 44.9,47.75 44.45,47.3 IC5.39 44.45,43.11 | IC7.2 52.2,62.29 C21.1 | IC1.6 10.54,47.62 10.67,47.75 | IC5.28 52.45,39.37
  Top 0.508: v32.51,66.8 32.51,66.58 31.91,65.98 | IC6.9 31.75,65.82 31.91,65.98 | T3.2 51.83,14.29 | 51.83,14.29 52.38,14.29 v52.58,14.48 52.49,14.64 51.83,14.29 | D2.3 52.83,74.87 | 52.83,74.87 v52.83,76.07 | 31.91,65.98 32.7,66.54 v32.51,66.8 | 31.91,65.98 32.26,66.9 v32.51,66.8 | 52.83,74.87 53.17,75.97 v52.83,76.07 | 52.83,74.87 52.5,75.97 v52.83,76.07
  Top 0.61: v46.99,30.48 45.79,30.48 | 45.79,30.48 C13.2 | 45.79,30.48 46.92,30.19 v46.99,30.48 | 45.79,30.48 46.92,30.77 v46.99,30.48
  Top 1.27: v22.86,76.96 C22.2
  other vias: 23.62,36.83 23.62,39.37 23.5,59.69 23.5,57.15 50.04,61.98 34.92,30.48 34.92,60.33 41.4,61.85 47.12,4.7 57.28,25.65 49.66,25.02 33.15,52.32 43.81,19.68 47.62,15.88 38.73,33.66 40.01,71.75 46.35,72.39 19.68,71.75 38.73,24.77
  pour Bottom (isolate 0.813, rank 4): 44.45,0.64 44.45,15.24 43.18,16.51 43.18,24.13 36.83,24.13 35.56,25.4 0.64,25.4 0.64,93.98 59.05,93.98 59.05,0.64
  pour Top (isolate 0.813, rank 4): 1.27,93.98 59.05,93.98 59.05,1.27 44.45,1.27 44.45,15.24 43.18,16.51 43.18,24.13 36.83,24.13 35.56,25.4 1.27,25.4
MISO  (1 unrouted)
  Top 0.305: IC5.2 39.78,42.57 40.01,42.8 40.01,43.81 38.92,44.9 38.92,47.43 38.1,48.25 38.1,49.16 arc-90 38.63,49.69 arc90 39.17,50.23 39.17,51 arc90 38.63,51.54 arc-90 38.1,52.07 IC6.15
MOSI  (1 unrouted)
  Top 0.305: IC6.14 36.83,47.62 arc90 37.36,47.09 37.77,47.09 arc-90 38.31,46.56 38.31,46.05 arc-90 37.77,45.51 37.36,45.51 arc90 36.83,44.98 36.83,44.07 37.53,43.37 IC5.1
N$1
  Top 0.508: R5.2 37.78,19.05 IC3.2
N$2
  Top 0.305: IC2.1 28.89,18.61 30.12,19.84 R3.1
N$3
  Top 0.508: IC3.3 37.3,17.78 T2.3
N$4
  Top 0.508: IC4.2 47.31,11.43 R9.1
N$5
  Top 0.508: T3.3 48.43,12.7 IC4.3
N$6
  Top 0.305: T1.1 36.66,9.84 R6.1
  Top 0.508: IC4.6 36.98,12.7 T1.1
N$7
  Top 0.305: T2.1 32.85,18.09 R3.2
N$8
  Top 0.406: R8.2 49.06,19.75 T4.1 48.75,17.78 IC3.6
N$9
  Top 0.508: R10.2 54.25,14.12 52.52,12.38 T3.1
N$10
  Top 0.305: IC2.4 26.99,17.08 27.56,16.51 27.94,16.51 30.16,14.29 R4.1
  Top 0.508: T1.3 33.66,13.34 32.7,14.29 R4.1
N$11  (2 unrouted)
N$12  (2 unrouted)
N$17
  Top 0.305: IC5.7 29.46,38.57 arc-90 28.19,39.84 Q1.1 28.19,43 28.05,42.86 C15.1
N$22
  Top 0.305: C19.1 23.56,53.59 Q2.2 27.69,55.84 arc-45 28.43,57.64 30.03,59.24 arc-45 31.11,59.69 arc45 32.2,60.14 33.55,61.49 arc45 34.29,63.28 IC6.7
N$24
  Top 0.305: IC5.8 29.46,37.77 arc90 28.19,36.5 Q1.2 28.13,33.34 C16.1
N$25
  Top 0.508: C1.1 17.62,3.32 L1.1
  Top 1.27: X1.1 14.87,12.44 17.62,9.69 L1.1
N$26
  Top 0.305: IC6.8 33.02,63.63 arc-90 31.75,62.36 28.57,62.36 | Q2.1 23.56,63.25 C20.1
  Top 0.406: 28.57,62.36 Q2.1
N$31
  Top 0.406: C22.1 31.62,76.96 arc-90 31.75,76.83 39.59,76.83 arc45 41.38,77.58 43.71,79.9 arc-45 45.5,80.64 51.65,80.64 arc-45 53.45,79.9 55.14,78.21 arc-45 55.88,76.42 55.88,72.65 arc-45 55.24,71.12 arc45 54.74,69.89 IC7.5
  pour Top (isolate 0.813, no thermals): 34.8,76.2 26.04,76.2 26.04,77.72 34.8,77.72
N$32
  pour Top (isolate 0.813, rank 3): 9.53,26.67 9.53,41.91 10.79,41.91 10.79,45.72 1.91,45.72 1.91,26.67
N$33
  pour Top (isolate 0.813, rank 2): 15.88,41.91 15.88,45.72 10.79,45.72 10.79,41.91
RST  (via drill 0.8)
  Top 0.305: v46.99,36.83 46.14,37.68 | 46.14,37.68 42.85,40.97 IC5.4 37.36,40.97 35.56,42.77 35.56,48.77 35.03,49.3 R11.1 | 46.14,37.68 46.58,36.65 v46.99,36.83 | 46.14,37.68 47.17,37.24 v46.99,36.83
  Bottom 0.305: X2.6 48.19,36.83 | 48.19,36.83 v46.99,36.83 | 48.19,36.83 47.16,37.25 v46.99,36.83 | 48.19,36.83 47.16,36.41 v46.99,36.83
RXCAN
  Top 0.406: IC6.2 40.64,65.41 arc-90 41.91,66.67 53.47,66.67 arc-90 54.74,65.41 IC7.4
SCK  (1 unrouted)
  Top 0.305: IC6.13 35.56,50.39 36.17,49.78 36.17,43.28 37.68,41.77 IC5.3
TCK
  Top 0.305: IC5.21 47.65,32.36 48.26,31.75 49.9,31.75 54.53,27.12 56.12,27.12 57.25,28.24 57.25,29.83 57.15,29.93 X2.1
TDI
  Top 0.305: IC5.24 51.46,36.17 53.39,38.1 55.24,38.1 55.88,38.73 55.88,39.37 X2.9
TDO
  Top 0.305: X2.3 55.88,34.29 55.88,34.92 55.24,35.56 52.07,35.56 51.88,35.37 IC5.23
TMS
  Top 0.305: IC5.22 48.45,33.47 48.9,33.02 55.24,33.02 56.52,31.75 57.78,31.75 58.42,32.38 58.42,33.66 57.15,34.92 X2.5
TXCAN
  Top 0.406: IC7.1 48.26,64.47 arc90 47.68,63.89 47.68,62.43 arc-90 47.09,61.84 47.08,61.84 arc-90 46.5,62.43 46.5,63.89 arc90 45.91,64.47 45.9,64.47 arc90 45.32,63.89 45.32,62.43 arc-90 44.73,61.84 44.72,61.84 arc-90 44.14,62.43 44.14,63.89 arc90 43.55,64.47 42.09,64.47 IC6.1
USART_RX
  Top 0.305: IC5.9 37.6,36.97 36.35,35.71 36.35,32.64 42.29,26.7 52.05,26.7 56.52,22.23 56.52,18.41 55.56,17.46 R7.2
  Top 0.61: R7.2 53.02,17.46 52.7,17.14 T4.3
USART_TX
  Top 0.305: IC5.10 37.72,36.17 36.96,35.41 36.96,32.89 42.55,27.3 52.3,27.3 57.12,22.48 57.12,12.68 55.73,11.28 R10.1
USB_D_N
  Top 0.305: IC2.9 24.45,13.14 23.62,13.97 R1.2
USB_D_P
  Top 0.305: IC2.8 24.45,17.21 23.75,16.51 R2.1
VCCIO  (via drill 0.4, 0.6)
  Top 0.305: IC2.3 C9.1 28.18,20.32 | IC2.10 IC2.11 25.72,13.46 | 25.72,13.46 25.72,13.65 v25.4,13.97 | v29.08,20.32 28.18,20.32 | 25.72,13.46 25.65,14 v25.4,13.97 | 25.72,13.46 25.26,13.76 v25.4,13.97 | 28.18,20.32 28.95,20 v29.08,20.32 | 28.18,20.32 28.95,20.64 v29.08,20.32
  Bottom 0.305: 28.45,19.68 26.67,17.91 26.67,15.24 25.82,14.39 | 28.45,19.68 v29.08,20.32 | v25.4,13.97 25.82,14.39 | 25.82,14.39 25.31,14.21 v25.4,13.97 | 25.82,14.39 25.64,13.88 v25.4,13.97 | 28.45,19.68 29.21,20 v29.08,20.32 | 28.45,19.68 28.76,20.45 v29.08,20.32

### Text on the board
tPlace: V+ (12 - 24 VDC)
tNames: CAN-USB / Marcin Wionczyk | V+ | GND | 1 - CAN_L | 2 - CAN_H | 3 - GND | 4 - V+ | 5 - V+ | 7 - GND